# Altium project SPT3G_LCTestBoard_Rev0.PrjPcb
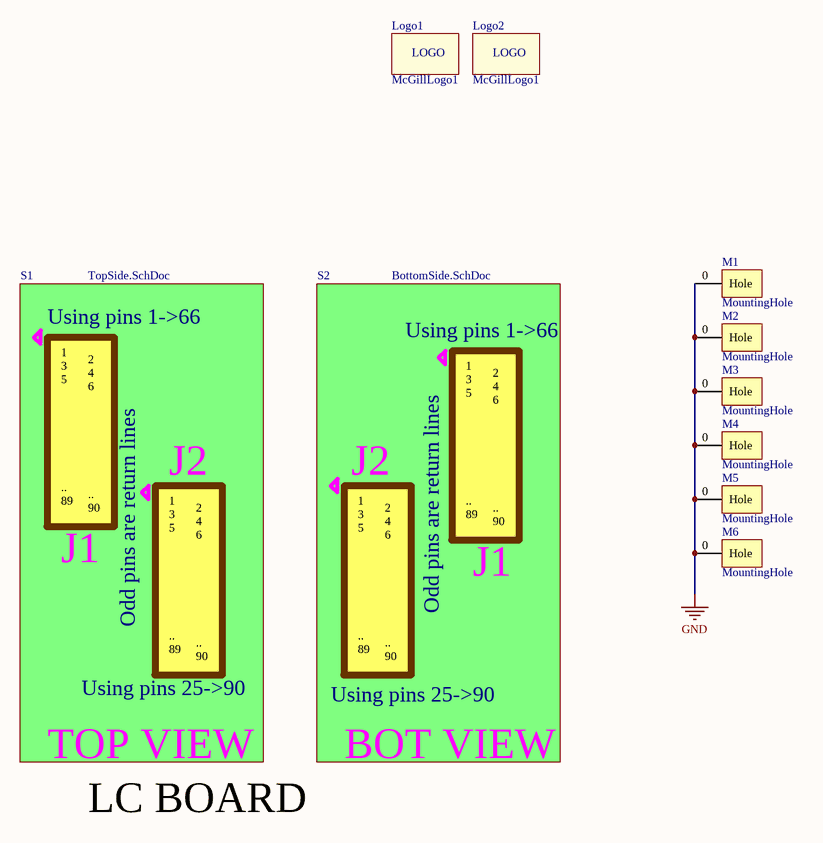
[diagram p0: TopLevelSchem.SchDoc]
DrawnBy: Adam Gilbert & Amy Bender; ProjectTitle: SPT3G LC board
4 sheets, 144 parts. Net scope: flat (ports and power ports of the same name join across sheets).
Board file: SPT3G_LCTestBoard.PcbDoc
Sheets:
  TopLevelSchem.SchDoc
    S1 = TopSide.SchDoc
      A = Resistors.SchDoc
    S2 = BottomSide.SchDoc
      B = Resistors.SchDoc

## Sheet TopLevelSchem.SchDoc
size Letter; DrawnBy: Adam Gilbert; Organization: Altium Limited; Address1: L3, 12a Rodborough Rd; Address2: Frenchs Forest; Address3: NSW; Address4: Australia 2086; DocumentNumber: 1; SheetNumber: 1; SheetTotal: 4

### Parts
Logo1  McGillLogo1  [McGillLogo1]  (no BOM)
Logo2  McGillLogo1  [McGillLogo1]  (no BOM)
M1  MountingHole  [MountingHole]  (no BOM)
M2  MountingHole  [MountingHole]  (no BOM)
M3  MountingHole  [MountingHole]  (no BOM)
M4  MountingHole  [MountingHole]  (no BOM)
M5  MountingHole  [MountingHole]  (no BOM)
M6  MountingHole  [MountingHole]  (no BOM)

### Sub-sheets
S1 = TopSide.SchDoc: no entries
S2 = BottomSide.SchDoc: no entries

### Nets
GND: M1.0(Hole) M2.0(Hole) M3.0(Hole) M4.0(Hole) M5.0(Hole) M6.0(Hole)

### Notes on the sheet
- Using pins 1->66
- 1
  3
  5
  ..
  89
- 2
  4
  6
  ..
  90
- J2
- J1
- Odd pins are return lines
- Using pins 25->90
- TOP VIEW
- BOT VIEW
- LC BOARD
- Title
- Size:
- Date:
- Letter
- Number:
- Time:
- Revision:
- Sheet
- of
- Cosmology
- File:
- (in symbol Logo) LOGO

### Library data of the parts
Logo1 Logo2 = Logo

## Sheet TopSide.SchDoc
size Letter; DrawnBy: Adam Gilbert; Organization: Altium Limited; Address1: L3, 12a Rodborough Rd; Address2: Frenchs Forest; Address3: NSW; Address4: Australia 2086; DocumentNumber: 2; SheetNumber: 2; SheetTotal: 4
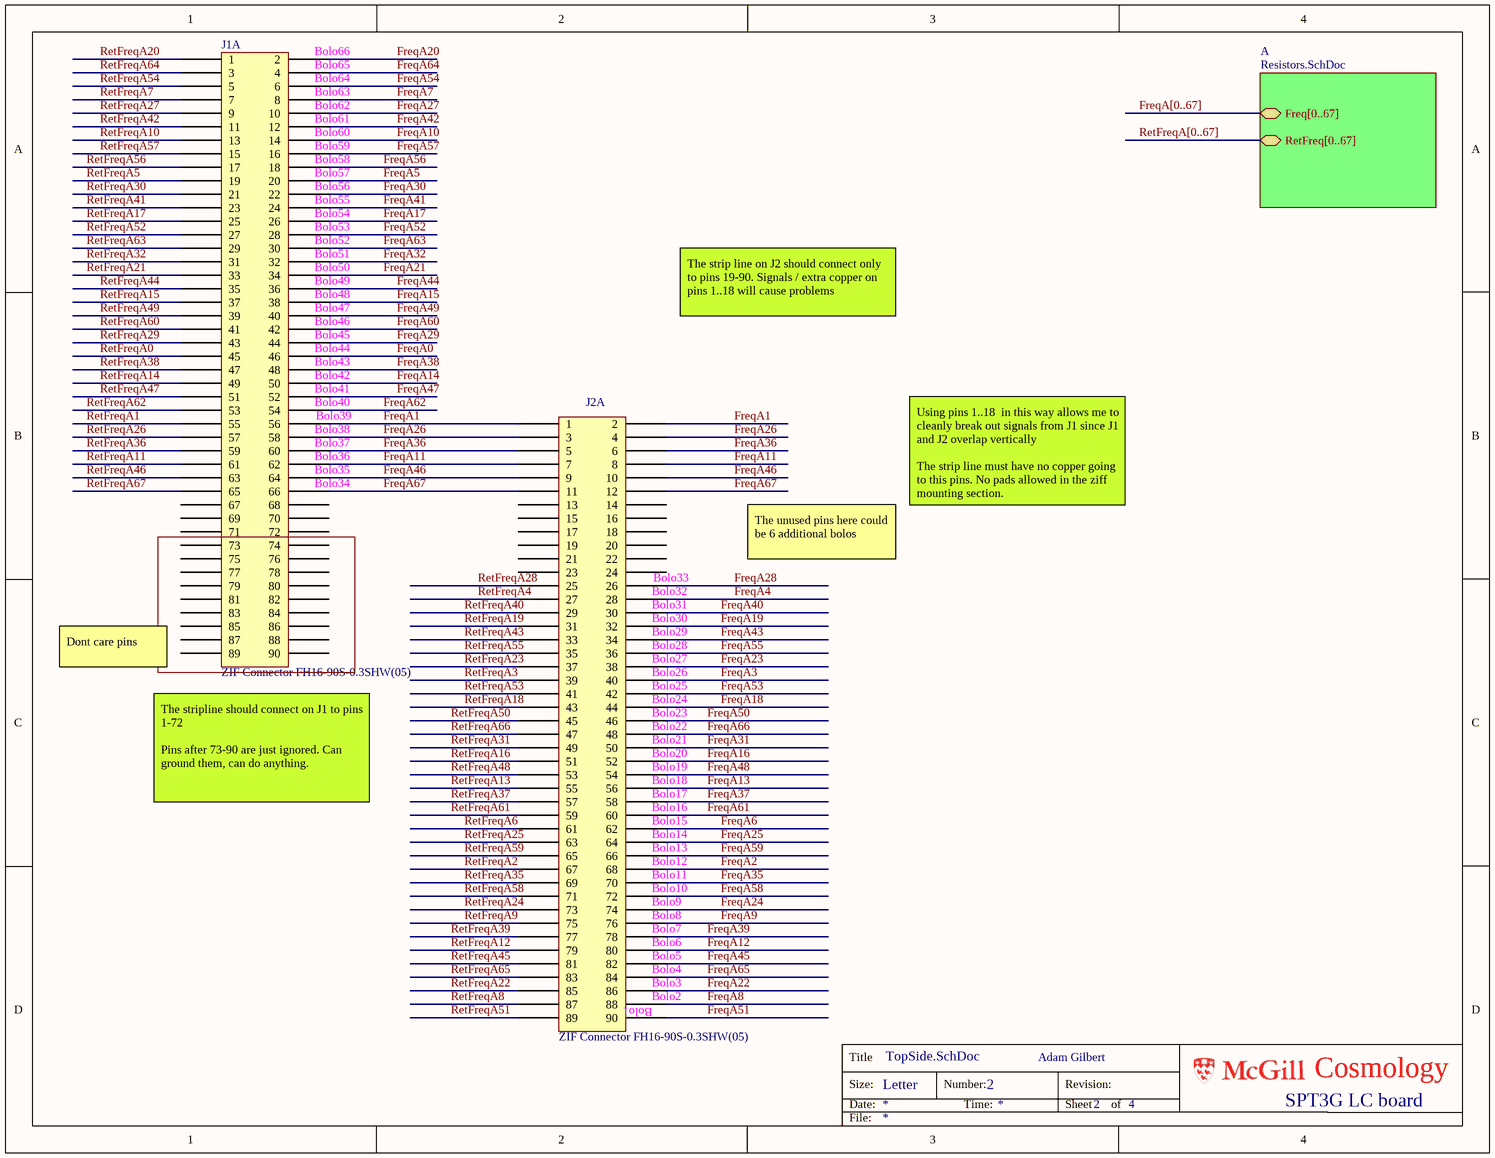
[diagram p1: TopSide.SchDoc]

### Parts
J1A  ZIF Connector FH16-90S-0.3SHW(05)  [LCBoard_ZIFCon]
J2A  ZIF Connector FH16-90S-0.3SHW(05)  [LCBoard_ZIFCon]

### Sub-sheets
A = Resistors.SchDoc: Freq[0..67], RetFreq[0..67]

### Nets
FreqA0: J1A.46
FreqA1: J1A.56 J2A.1 J2A.2
FreqA2: J2A.68
FreqA3: J2A.40
FreqA4: J2A.28
FreqA5: J1A.20
FreqA6: J2A.62
FreqA7: J1A.8
FreqA8: J2A.88
FreqA9: J2A.76
FreqA10: J1A.14
FreqA11: J1A.62 J2A.7 J2A.8
FreqA12: J2A.80
FreqA13: J2A.56
FreqA14: J1A.50
FreqA15: J1A.38
FreqA16: J2A.52
FreqA17: J1A.26
FreqA18: J2A.44
FreqA19: J2A.32
FreqA20: J1A.2
FreqA21: J1A.34
FreqA22: J2A.86
FreqA23: J2A.38
FreqA24: J2A.74
FreqA25: J2A.64
FreqA26: J1A.58 J2A.3 J2A.4
FreqA27: J1A.10
FreqA28: J2A.26
FreqA29: J1A.44
FreqA30: J1A.22
FreqA31: J2A.50
FreqA32: J1A.32
FreqA35: J2A.70
FreqA36: J1A.60 J2A.5 J2A.6
FreqA37: J2A.58
FreqA38: J1A.48
FreqA39: J2A.78
FreqA40: J2A.30
FreqA41: J1A.24
FreqA42: J1A.12
FreqA43: J2A.34
FreqA44: J1A.36
FreqA45: J2A.82
FreqA46: J1A.64 J2A.9 J2A.10
FreqA47: J1A.52
FreqA48: J2A.54
FreqA49: J1A.40
FreqA50: J2A.46
FreqA51: J2A.90
FreqA52: J1A.28
FreqA53: J2A.42
FreqA54: J1A.6
FreqA55: J2A.36
FreqA56: J1A.18
FreqA57: J1A.16
FreqA58: J2A.72
FreqA59: J2A.66
FreqA60: J1A.42
FreqA61: J2A.60
FreqA62: J1A.54
FreqA63: J1A.30
FreqA64: J1A.4
FreqA65: J2A.84
FreqA66: J2A.48
FreqA67: J1A.66 J2A.11 J2A.12
RetFreqA0: J1A.45
RetFreqA1: J1A.55
RetFreqA2: J2A.67
RetFreqA3: J2A.39
RetFreqA4: J2A.27
RetFreqA5: J1A.19
RetFreqA6: J2A.61
RetFreqA7: J1A.7
RetFreqA8: J2A.87
RetFreqA9: J2A.75
RetFreqA10: J1A.13
RetFreqA11: J1A.61
RetFreqA12: J2A.79
RetFreqA13: J2A.55
RetFreqA14: J1A.49
RetFreqA15: J1A.37
RetFreqA16: J2A.51
RetFreqA17: J1A.25
RetFreqA18: J2A.43
RetFreqA19: J2A.31
RetFreqA20: J1A.1
RetFreqA21: J1A.33
RetFreqA22: J2A.85
RetFreqA23: J2A.37
RetFreqA24: J2A.73
RetFreqA25: J2A.63
RetFreqA26: J1A.57
RetFreqA27: J1A.9
RetFreqA28: J2A.25
RetFreqA29: J1A.43
RetFreqA30: J1A.21
RetFreqA31: J2A.49
RetFreqA32: J1A.31
RetFreqA35: J2A.69
RetFreqA36: J1A.59
RetFreqA37: J2A.57
RetFreqA38: J1A.47
RetFreqA39: J2A.77
RetFreqA40: J2A.29
RetFreqA41: J1A.23
RetFreqA42: J1A.11
RetFreqA43: J2A.33
RetFreqA44: J1A.35
RetFreqA45: J2A.81
RetFreqA46: J1A.63
RetFreqA47: J1A.51
RetFreqA48: J2A.53
RetFreqA49: J1A.39
RetFreqA50: J2A.45
RetFreqA51: J2A.89
RetFreqA52: J1A.27
RetFreqA53: J2A.41
RetFreqA54: J1A.5
RetFreqA55: J2A.35
RetFreqA56: J1A.17
RetFreqA57: J1A.15
RetFreqA58: J2A.71
RetFreqA59: J2A.65
RetFreqA60: J1A.41
RetFreqA61: J2A.59
RetFreqA62: J1A.53
RetFreqA63: J1A.29
RetFreqA64: J1A.3
RetFreqA65: J2A.83
RetFreqA66: J2A.47
RetFreqA67: J1A.65

Not connected (* = marked no-connect by the designer): J1A 67 68 69 70 71 72 73 74 75 76 77 78 79 80 81 82 83 84 85 86 87 88 89 90; J2A 13 14 15 16 17 18 19 20 21 22 23 24

### Buses and harness runs
bus FreqA[0..67] = sheet A/Freq[0..67]
bus RetFreqA[0..67] = sheet A/RetFreq[0..67]

### Notes on the sheet
- (near J1A) Bolo63
- (near J1A) Bolo64
- (near J1A) Bolo65
- (near J1A) Bolo66
- (near J1A) Bolo58
- (near J1A) Bolo59
- (near J1A) Bolo60
- (near J1A) Bolo61
- (near J1A) Bolo62
- (near J1A) Bolo53
- (near J1A) Bolo54
- (near J1A) Bolo55
- (near J1A) Bolo56
- (near J1A) Bolo57
- (near J1A) Bolo48
- (near J1A) Bolo49
- (near J1A) Bolo50
- (near J1A) Bolo51
- (near J1A) Bolo52
- (near J1A) Bolo43
- (near J1A) Bolo44
- (near J1A) Bolo45
- (near J1A) Bolo46
- (near J1A) Bolo47
- The strip line on J2 should connect only to pins 19-90. Signals / extra copper on pins 1..18 will cause problems
- (near J1A) Bolo40
- (near J1A) Bolo41
- (near J1A) Bolo42
- (near J1A) Bolo38
- (near J1A) Bolo39
- (near J1A) Bolo34
- (near J1A) Bolo35
- (near J1A) Bolo36
- (near J1A) Bolo37
- Using pins 1..18  in this way allows me to cleanly break out signals from J1 since J1 and J2 overlap vertically
  The strip line must have no copper going to this pins. No pads allowed in the ziff mounting section.
- The unused pins here could be 6 additional bolos
- (near J2A) Bolo29
- (near J2A) Bolo30
- (near J2A) Bolo31
- (near J2A) Bolo32
- (near J2A) Bolo33
- Dont care pins
- (near J2A) Bolo24
- (near J2A) Bolo25
- (near J2A) Bolo26
- (near J2A) Bolo27
- (near J2A) Bolo28
- (near J2A) Bolo19
- (near J2A) Bolo20
- (near J2A) Bolo21
- (near J2A) Bolo22
- (near J2A) Bolo23
- (near J1A) The stripline should connect on J1 to pins 1-72
  Pins after 73-90 are just ignored. Can ground them, can do anything.
- (near J2A) Bolo14
- (near J2A) Bolo15
- (near J2A) Bolo16
- (near J2A) Bolo17
- (near J2A) Bolo18
- (near J2A) Bolo9
- (near J2A) Bolo10
- (near J2A) Bolo11
- (near J2A) Bolo12
- (near J2A) Bolo13
- (near J2A) Bolo4
- (near J2A) Bolo5
- (near J2A) Bolo6
- (near J2A) Bolo7
- (near J2A) Bolo8
- (near J2A) Bolo2
- (near J2A) Bolo3
- (near J2A) Bolo1
- Title
- Size:
- Date:
- Letter
- Number:
- Time:
- Revision:
- Sheet
- of
- Cosmology
- File:

### Library data of the parts
J1A J2A = LCboard_FH16-90S-0.3SHW(05)

## Sheet Resistors.SchDoc
size Letter; DrawnBy: Adam Gilbert; Organization: Altium Limited; Address1: L3, 12a Rodborough Rd; Address2: Frenchs Forest; Address3: NSW; Address4: Australia 2086; DocumentNumber: 4; SheetNumber: 4; SheetTotal: 4
Used 2 times, as channels S1/A, S2/B. Parts and nets are listed once, with the designators drawn on the sheet.
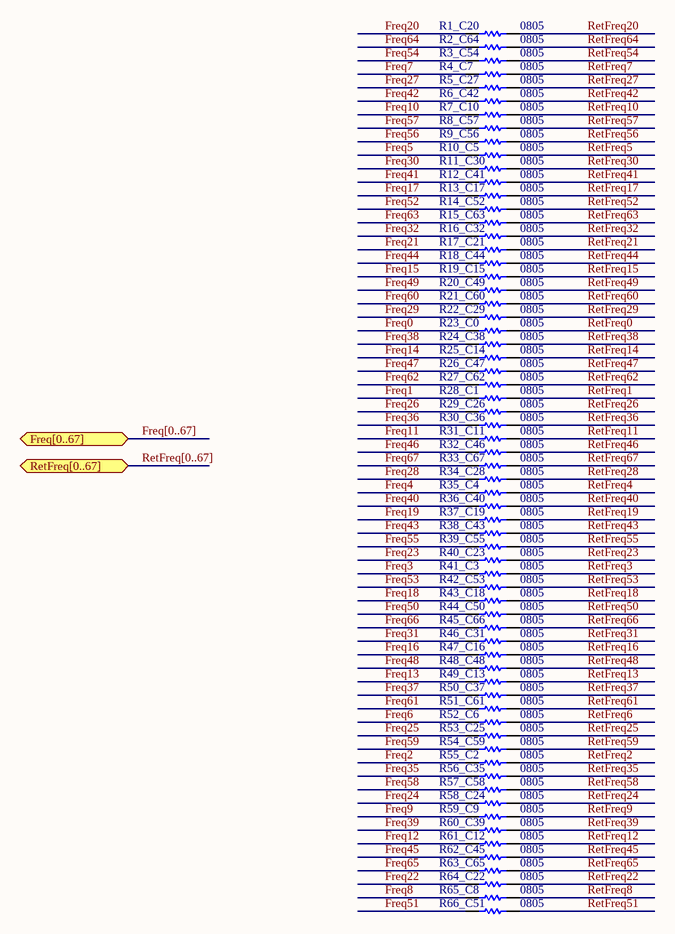
[diagram p2: Resistors.SchDoc]

### Parts
R1_C20  Res0805  [0805]  (value not drawn)
R2_C64  Res0805  [0805]  (value not drawn)
R3_C54  Res0805  [0805]  (value not drawn)
R4_C7  Res0805  [0805]  (value not drawn)
R5_C27  Res0805  [0805]  (value not drawn)
R6_C42  Res0805  [0805]  (value not drawn)
R7_C10  Res0805  [0805]  (value not drawn)
R8_C57  Res0805  [0805]  (value not drawn)
R9_C56  Res0805  [0805]  (value not drawn)
R10_C5  Res0805  [0805]  (value not drawn)
R11_C30  Res0805  [0805]  (value not drawn)
R12_C41  Res0805  [0805]  (value not drawn)
R13_C17  Res0805  [0805]  (value not drawn)
R14_C52  Res0805  [0805]  (value not drawn)
R15_C63  Res0805  [0805]  (value not drawn)
R16_C32  Res0805  [0805]  (value not drawn)
R17_C21  Res0805  [0805]  (value not drawn)
R18_C44  Res0805  [0805]  (value not drawn)
R19_C15  Res0805  [0805]  (value not drawn)
R20_C49  Res0805  [0805]  (value not drawn)
R21_C60  Res0805  [0805]  (value not drawn)
R22_C29  Res0805  [0805]  (value not drawn)
R23_C0  Res0805  [0805]  (value not drawn)
R24_C38  Res0805  [0805]  (value not drawn)
R25_C14  Res0805  [0805]  (value not drawn)
R26_C47  Res0805  [0805]  (value not drawn)
R27_C62  Res0805  [0805]  (value not drawn)
R28_C1  Res0805  [0805]  (value not drawn)
R29_C26  Res0805  [0805]  (value not drawn)
R30_C36  Res0805  [0805]  (value not drawn)
R31_C11  Res0805  [0805]  (value not drawn)
R32_C46  Res0805  [0805]  (value not drawn)
R33_C67  Res0805  [0805]  (value not drawn)
R34_C28  Res0805  [0805]  (value not drawn)
R35_C4  Res0805  [0805]  (value not drawn)
R36_C40  Res0805  [0805]  (value not drawn)
R37_C19  Res0805  [0805]  (value not drawn)
R38_C43  Res0805  [0805]  (value not drawn)
R39_C55  Res0805  [0805]  (value not drawn)
R40_C23  Res0805  [0805]  (value not drawn)
R41_C3  Res0805  [0805]  (value not drawn)
R42_C53  Res0805  [0805]  (value not drawn)
R43_C18  Res0805  [0805]  (value not drawn)
R44_C50  Res0805  [0805]  (value not drawn)
R45_C66  Res0805  [0805]  (value not drawn)
R46_C31  Res0805  [0805]  (value not drawn)
R47_C16  Res0805  [0805]  (value not drawn)
R48_C48  Res0805  [0805]  (value not drawn)
R49_C13  Res0805  [0805]  (value not drawn)
R50_C37  Res0805  [0805]  (value not drawn)
R51_C61  Res0805  [0805]  (value not drawn)
R52_C6  Res0805  [0805]  (value not drawn)
R53_C25  Res0805  [0805]  (value not drawn)
R54_C59  Res0805  [0805]  (value not drawn)
R55_C2  Res0805  [0805]  (value not drawn)
R56_C35  Res0805  [0805]  (value not drawn)
R57_C58  Res0805  [0805]  (value not drawn)
R58_C24  Res0805  [0805]  (value not drawn)
R59_C9  Res0805  [0805]  (value not drawn)
R60_C39  Res0805  [0805]  (value not drawn)
R61_C12  Res0805  [0805]  (value not drawn)
R62_C45  Res0805  [0805]  (value not drawn)
R63_C65  Res0805  [0805]  (value not drawn)
R64_C22  Res0805  [0805]  (value not drawn)
R65_C8  Res0805  [0805]  (value not drawn)
R66_C51  Res0805  [0805]  (value not drawn)

### Ports
Freq[0..67], RetFreq[0..67]

### Nets
Freq0: R23_C0.1
Freq1: R28_C1.1
Freq2: R55_C2.1
Freq3: R41_C3.1
Freq4: R35_C4.1
Freq5: R10_C5.1
Freq6: R52_C6.1
Freq7: R4_C7.1
Freq8: R65_C8.1
Freq9: R59_C9.1
Freq10: R7_C10.1
Freq11: R31_C11.1
Freq12: R61_C12.1
Freq13: R49_C13.1
Freq14: R25_C14.1
Freq15: R19_C15.1
Freq16: R47_C16.1
Freq17: R13_C17.1
Freq18: R43_C18.1
Freq19: R37_C19.1
Freq20: R1_C20.1
Freq21: R17_C21.1
Freq22: R64_C22.1
Freq23: R40_C23.1
Freq24: R58_C24.1
Freq25: R53_C25.1
Freq26: R29_C26.1
Freq27: R5_C27.1
Freq28: R34_C28.1
Freq29: R22_C29.1
Freq30: R11_C30.1
Freq31: R46_C31.1
Freq32: R16_C32.1
Freq35: R56_C35.1
Freq36: R30_C36.1
Freq37: R50_C37.1
Freq38: R24_C38.1
Freq39: R60_C39.1
Freq40: R36_C40.1
Freq41: R12_C41.1
Freq42: R6_C42.1
Freq43: R38_C43.1
Freq44: R18_C44.1
Freq45: R62_C45.1
Freq46: R32_C46.1
Freq47: R26_C47.1
Freq48: R48_C48.1
Freq49: R20_C49.1
Freq50: R44_C50.1
Freq51: R66_C51.1
Freq52: R14_C52.1
Freq53: R42_C53.1
Freq54: R3_C54.1
Freq55: R39_C55.1
Freq56: R9_C56.1
Freq57: R8_C57.1
Freq58: R57_C58.1
Freq59: R54_C59.1
Freq60: R21_C60.1
Freq61: R51_C61.1
Freq62: R27_C62.1
Freq63: R15_C63.1
Freq64: R2_C64.1
Freq65: R63_C65.1
Freq66: R45_C66.1
Freq67: R33_C67.1
RetFreq0: R23_C0.2
RetFreq1: R28_C1.2
RetFreq2: R55_C2.2
RetFreq3: R41_C3.2
RetFreq4: R35_C4.2
RetFreq5: R10_C5.2
RetFreq6: R52_C6.2
RetFreq7: R4_C7.2
RetFreq8: R65_C8.2
RetFreq9: R59_C9.2
RetFreq10: R7_C10.2
RetFreq11: R31_C11.2
RetFreq12: R61_C12.2
RetFreq13: R49_C13.2
RetFreq14: R25_C14.2
RetFreq15: R19_C15.2
RetFreq16: R47_C16.2
RetFreq17: R13_C17.2
RetFreq18: R43_C18.2
RetFreq19: R37_C19.2
RetFreq20: R1_C20.2
RetFreq21: R17_C21.2
RetFreq22: R64_C22.2
RetFreq23: R40_C23.2
RetFreq24: R58_C24.2
RetFreq25: R53_C25.2
RetFreq26: R29_C26.2
RetFreq27: R5_C27.2
RetFreq28: R34_C28.2
RetFreq29: R22_C29.2
RetFreq30: R11_C30.2
RetFreq31: R46_C31.2
RetFreq32: R16_C32.2
RetFreq35: R56_C35.2
RetFreq36: R30_C36.2
RetFreq37: R50_C37.2
RetFreq38: R24_C38.2
RetFreq39: R60_C39.2
RetFreq40: R36_C40.2
RetFreq41: R12_C41.2
RetFreq42: R6_C42.2
RetFreq43: R38_C43.2
RetFreq44: R18_C44.2
RetFreq45: R62_C45.2
RetFreq46: R32_C46.2
RetFreq47: R26_C47.2
RetFreq48: R48_C48.2
RetFreq49: R20_C49.2
RetFreq50: R44_C50.2
RetFreq51: R66_C51.2
RetFreq52: R14_C52.2
RetFreq53: R42_C53.2
RetFreq54: R3_C54.2
RetFreq55: R39_C55.2
RetFreq56: R9_C56.2
RetFreq57: R8_C57.2
RetFreq58: R57_C58.2
RetFreq59: R54_C59.2
RetFreq60: R21_C60.2
RetFreq61: R51_C61.2
RetFreq62: R27_C62.2
RetFreq63: R15_C63.2
RetFreq64: R2_C64.2
RetFreq65: R63_C65.2
RetFreq66: R45_C66.2
RetFreq67: R33_C67.2

### Channels
S1/A: designators end in _A
S2/B: designators end in _B

### Buses and harness runs
bus Freq[0..67] = port Freq[0..67]
bus RetFreq[0..67] = port RetFreq[0..67]

### Notes on the sheet
- Title
- Size:
- Date:
- Letter
- Number:
- Time:
- Revision:
- Sheet
- of
- Cosmology
- File:

### Library data of the parts
R1_C20 R2_C64 R3_C54 R4_C7 R5_C27 R6_C42 R7_C10 R8_C57 R9_C56 R10_C5 R11_C30 R12_C41 R13_C17 R14_C52 R15_C63 R16_C32 R17_C21 R18_C44 R19_C15 R20_C49 R21_C60 R22_C29 R23_C0 R24_C38 R25_C14 R26_C47 R27_C62 R28_C1 R29_C26 R30_C36 R31_C11 R32_C46 R33_C67 R34_C28 R35_C4 R36_C40 R37_C19 R38_C43 R39_C55 R40_C23 R41_C3 R42_C53 R43_C18 R44_C50 R45_C66 R46_C31 R47_C16 R48_C48 R49_C13 R50_C37 R51_C61 R52_C6 R53_C25 R54_C59 R55_C2 R56_C35 R57_C58 R58_C24 R59_C9 R60_C39 R61_C12 R62_C45 R63_C65 R64_C22 R65_C8 R66_C51 = Res0805: Resistor; Param1: 100ppm/C; Param: 1%; TechInfo: *; Value: Value

## Sheet BottomSide.SchDoc
size Letter; DrawnBy: Adam Gilbert; Organization: Altium Limited; Address1: L3, 12a Rodborough Rd; Address2: Frenchs Forest; Address3: NSW; Address4: Australia 2086; DocumentNumber: 3; SheetNumber: 3; SheetTotal: 4
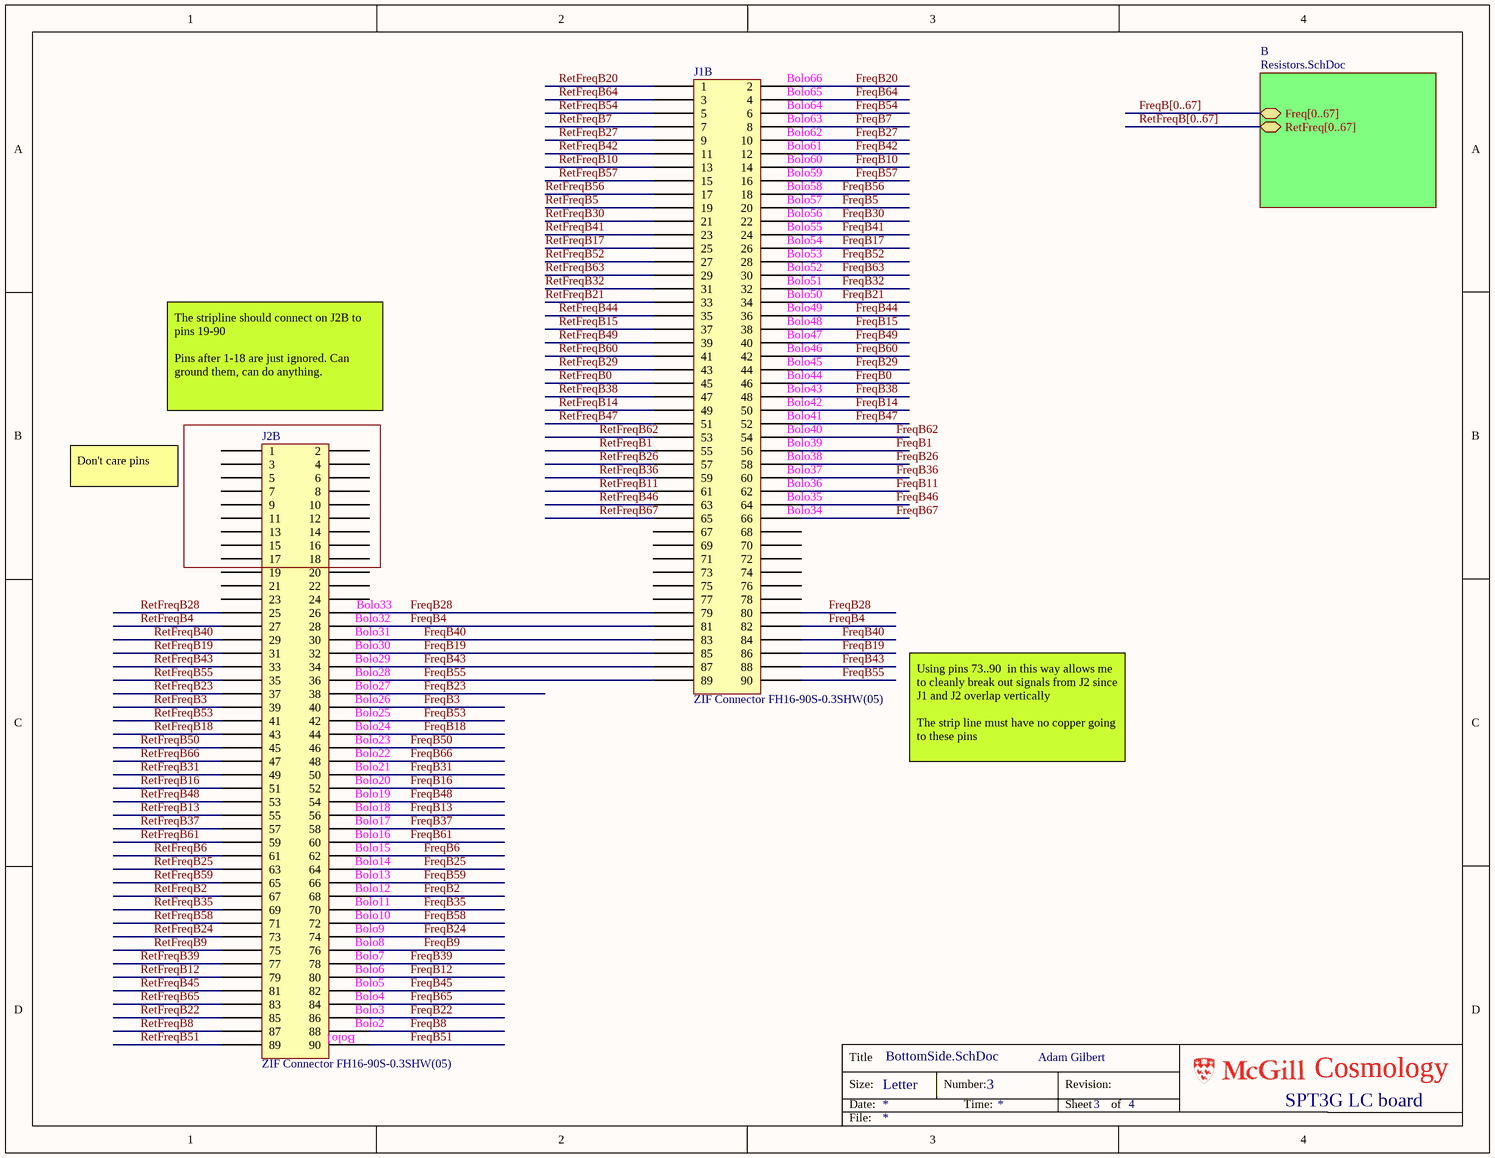
[diagram p3: BottomSide.SchDoc]

### Parts
J1B  ZIF Connector FH16-90S-0.3SHW(05)  [LCBoard_ZIFCon]
J2B  ZIF Connector FH16-90S-0.3SHW(05)  [LCBoard_ZIFCon]

### Sub-sheets
B = Resistors.SchDoc: Freq[0..67], RetFreq[0..67]

### Nets
FreqB0: J1B.46
FreqB1: J1B.56
FreqB2: J2B.68
FreqB3: J2B.40
FreqB4: J1B.81 J1B.82 J2B.28
FreqB5: J1B.20
FreqB6: J2B.62
FreqB7: J1B.8
FreqB8: J2B.88
FreqB9: J2B.76
FreqB10: J1B.14
FreqB11: J1B.62
FreqB12: J2B.80
FreqB13: J2B.56
FreqB14: J1B.50
FreqB15: J1B.38
FreqB16: J2B.52
FreqB17: J1B.26
FreqB18: J2B.44
FreqB19: J1B.85 J1B.86 J2B.32
FreqB20: J1B.2
FreqB21: J1B.34
FreqB22: J2B.86
FreqB23: J2B.38
FreqB24: J2B.74
FreqB25: J2B.64
FreqB26: J1B.58
FreqB27: J1B.10
FreqB28: J1B.79 J1B.80 J2B.26
FreqB29: J1B.44
FreqB30: J1B.22
FreqB31: J2B.50
FreqB32: J1B.32
FreqB35: J2B.70
FreqB36: J1B.60
FreqB37: J2B.58
FreqB38: J1B.48
FreqB39: J2B.78
FreqB40: J1B.83 J1B.84 J2B.30
FreqB41: J1B.24
FreqB42: J1B.12
FreqB43: J1B.87 J1B.88 J2B.34
FreqB44: J1B.36
FreqB45: J2B.82
FreqB46: J1B.64
FreqB47: J1B.52
FreqB48: J2B.54
FreqB49: J1B.40
FreqB50: J2B.46
FreqB51: J2B.90
FreqB52: J1B.28
FreqB53: J2B.42
FreqB54: J1B.6
FreqB55: J1B.89 J1B.90 J2B.36
FreqB56: J1B.18
FreqB57: J1B.16
FreqB58: J2B.72
FreqB59: J2B.66
FreqB60: J1B.42
FreqB61: J2B.60
FreqB62: J1B.54
FreqB63: J1B.30
FreqB64: J1B.4
FreqB65: J2B.84
FreqB66: J2B.48
FreqB67: J1B.66
RetFreqB0: J1B.45
RetFreqB1: J1B.55
RetFreqB2: J2B.67
RetFreqB3: J2B.39
RetFreqB4: J2B.27
RetFreqB5: J1B.19
RetFreqB6: J2B.61
RetFreqB7: J1B.7
RetFreqB8: J2B.87
RetFreqB9: J2B.75
RetFreqB10: J1B.13
RetFreqB11: J1B.61
RetFreqB12: J2B.79
RetFreqB13: J2B.55
RetFreqB14: J1B.49
RetFreqB15: J1B.37
RetFreqB16: J2B.51
RetFreqB17: J1B.25
RetFreqB18: J2B.43
RetFreqB19: J2B.31
RetFreqB20: J1B.1
RetFreqB21: J1B.33
RetFreqB22: J2B.85
RetFreqB23: J2B.37
RetFreqB24: J2B.73
RetFreqB25: J2B.63
RetFreqB26: J1B.57
RetFreqB27: J1B.9
RetFreqB28: J2B.25
RetFreqB29: J1B.43
RetFreqB30: J1B.21
RetFreqB31: J2B.49
RetFreqB32: J1B.31
RetFreqB35: J2B.69
RetFreqB36: J1B.59
RetFreqB37: J2B.57
RetFreqB38: J1B.47
RetFreqB39: J2B.77
RetFreqB40: J2B.29
RetFreqB41: J1B.23
RetFreqB42: J1B.11
RetFreqB43: J2B.33
RetFreqB44: J1B.35
RetFreqB45: J2B.81
RetFreqB46: J1B.63
RetFreqB47: J1B.51
RetFreqB48: J2B.53
RetFreqB49: J1B.39
RetFreqB50: J2B.45
RetFreqB51: J2B.89
RetFreqB52: J1B.27
RetFreqB53: J2B.41
RetFreqB54: J1B.5
RetFreqB55: J2B.35
RetFreqB56: J1B.17
RetFreqB57: J1B.15
RetFreqB58: J2B.71
RetFreqB59: J2B.65
RetFreqB60: J1B.41
RetFreqB61: J2B.59
RetFreqB62: J1B.53
RetFreqB63: J1B.29
RetFreqB64: J1B.3
RetFreqB65: J2B.83
RetFreqB66: J2B.47
RetFreqB67: J1B.65

Not connected (* = marked no-connect by the designer): J1B 67 68 69 70 71 72 73 74 75 76 77 78; J2B 1 2 3 4 5 6 7 8 9 10 11 12 13 14 15 16 17 18 19 20 21 22 23 24

### Buses and harness runs
bus FreqB[0..67] = sheet B/Freq[0..67]
bus RetFreqB[0..67] = sheet B/RetFreq[0..67]

### Notes on the sheet
- (near J1B) Bolo65
- (near J1B) Bolo66
- (near J1B) Bolo60
- (near J1B) Bolo61
- (near J1B) Bolo62
- (near J1B) Bolo63
- (near J1B) Bolo64
- (near J1B) Bolo55
- (near J1B) Bolo56
- (near J1B) Bolo57
- (near J1B) Bolo58
- (near J1B) Bolo59
- (near J1B) Bolo50
- (near J1B) Bolo51
- (near J1B) Bolo52
- (near J1B) Bolo53
- (near J1B) Bolo54
- (near J1B) Bolo45
- (near J1B) Bolo46
- (near J1B) Bolo47
- (near J1B) Bolo48
- (near J1B) Bolo49
- (near J2B) The stripline should connect on J2B to pins 19-90
  Pins after 1-18 are just ignored. Can ground them, can do anything.
- (near J1B) Bolo40
- (near J1B) Bolo41
- (near J1B) Bolo42
- (near J1B) Bolo43
- (near J1B) Bolo44
- Don't care pins
- (near J1B) Bolo35
- (near J1B) Bolo36
- (near J1B) Bolo37
- (near J1B) Bolo38
- (near J1B) Bolo39
- (near J1B) Bolo34
- (near J2B) Bolo31
- (near J2B) Bolo32
- (near J2B) Bolo33
- (near J2B) Bolo26
- (near J2B) Bolo27
- (near J2B) Bolo28
- (near J2B) Bolo29
- (near J2B) Bolo30
- (near J2B) Bolo21
- (near J2B) Bolo22
- (near J2B) Bolo23
- (near J2B) Bolo24
- (near J2B) Bolo25
- Using pins 73..90  in this way allows me to cleanly break out signals from J2 since J1 and J2 overlap vertically
  The strip line must have no copper going to these pins
- (near J2B) Bolo16
- (near J2B) Bolo17
- (near J2B) Bolo18
- (near J2B) Bolo19
- (near J2B) Bolo20
- (near J2B) Bolo11
- (near J2B) Bolo12
- (near J2B) Bolo13
- (near J2B) Bolo14
- (near J2B) Bolo15
- (near J2B) Bolo6
- (near J2B) Bolo7
- (near J2B) Bolo8
- (near J2B) Bolo9
- (near J2B) Bolo10
- (near J2B) Bolo2
- (near J2B) Bolo3
- (near J2B) Bolo4
- (near J2B) Bolo5
- (near J2B) Bolo1
- Title
- Size:
- Date:
- Letter
- Number:
- Time:
- Revision:
- Sheet
- of
- Cosmology
- File:

### Library data of the parts
J1B J2B = LCboard_FH16-90S-0.3SHW(05)

## Nets that join several sheets
Freq0: S1/A (R23_C0_A.1), S2/B (R23_C0_B.1)
Freq1: S1/A (R28_C1_A.1), S2/B (R28_C1_B.1)
Freq2: S1/A (R55_C2_A.1), S2/B (R55_C2_B.1)
Freq3: S1/A (R41_C3_A.1), S2/B (R41_C3_B.1)
Freq4: S1/A (R35_C4_A.1), S2/B (R35_C4_B.1)
Freq5: S1/A (R10_C5_A.1), S2/B (R10_C5_B.1)
Freq6: S1/A (R52_C6_A.1), S2/B (R52_C6_B.1)
Freq7: S1/A (R4_C7_A.1), S2/B (R4_C7_B.1)
Freq8: S1/A (R65_C8_A.1), S2/B (R65_C8_B.1)
Freq9: S1/A (R59_C9_A.1), S2/B (R59_C9_B.1)
Freq10: S1/A (R7_C10_A.1), S2/B (R7_C10_B.1)
Freq11: S1/A (R31_C11_A.1), S2/B (R31_C11_B.1)
Freq12: S1/A (R61_C12_A.1), S2/B (R61_C12_B.1)
Freq13: S1/A (R49_C13_A.1), S2/B (R49_C13_B.1)
Freq14: S1/A (R25_C14_A.1), S2/B (R25_C14_B.1)
Freq15: S1/A (R19_C15_A.1), S2/B (R19_C15_B.1)
Freq16: S1/A (R47_C16_A.1), S2/B (R47_C16_B.1)
Freq17: S1/A (R13_C17_A.1), S2/B (R13_C17_B.1)
Freq18: S1/A (R43_C18_A.1), S2/B (R43_C18_B.1)
Freq19: S1/A (R37_C19_A.1), S2/B (R37_C19_B.1)
Freq20: S1/A (R1_C20_A.1), S2/B (R1_C20_B.1)
Freq21: S1/A (R17_C21_A.1), S2/B (R17_C21_B.1)
Freq22: S1/A (R64_C22_A.1), S2/B (R64_C22_B.1)
Freq23: S1/A (R40_C23_A.1), S2/B (R40_C23_B.1)
Freq24: S1/A (R58_C24_A.1), S2/B (R58_C24_B.1)
Freq25: S1/A (R53_C25_A.1), S2/B (R53_C25_B.1)
Freq26: S1/A (R29_C26_A.1), S2/B (R29_C26_B.1)
Freq27: S1/A (R5_C27_A.1), S2/B (R5_C27_B.1)
Freq28: S1/A (R34_C28_A.1), S2/B (R34_C28_B.1)
Freq29: S1/A (R22_C29_A.1), S2/B (R22_C29_B.1)
Freq30: S1/A (R11_C30_A.1), S2/B (R11_C30_B.1)
Freq31: S1/A (R46_C31_A.1), S2/B (R46_C31_B.1)
Freq32: S1/A (R16_C32_A.1), S2/B (R16_C32_B.1)
Freq35: S1/A (R56_C35_A.1), S2/B (R56_C35_B.1)
Freq36: S1/A (R30_C36_A.1), S2/B (R30_C36_B.1)
Freq37: S1/A (R50_C37_A.1), S2/B (R50_C37_B.1)
Freq38: S1/A (R24_C38_A.1), S2/B (R24_C38_B.1)
Freq39: S1/A (R60_C39_A.1), S2/B (R60_C39_B.1)
Freq40: S1/A (R36_C40_A.1), S2/B (R36_C40_B.1)
Freq41: S1/A (R12_C41_A.1), S2/B (R12_C41_B.1)
Freq42: S1/A (R6_C42_A.1), S2/B (R6_C42_B.1)
Freq43: S1/A (R38_C43_A.1), S2/B (R38_C43_B.1)
Freq44: S1/A (R18_C44_A.1), S2/B (R18_C44_B.1)
Freq45: S1/A (R62_C45_A.1), S2/B (R62_C45_B.1)
Freq46: S1/A (R32_C46_A.1), S2/B (R32_C46_B.1)
Freq47: S1/A (R26_C47_A.1), S2/B (R26_C47_B.1)
Freq48: S1/A (R48_C48_A.1), S2/B (R48_C48_B.1)
Freq49: S1/A (R20_C49_A.1), S2/B (R20_C49_B.1)
Freq50: S1/A (R44_C50_A.1), S2/B (R44_C50_B.1)
Freq51: S1/A (R66_C51_A.1), S2/B (R66_C51_B.1)
Freq52: S1/A (R14_C52_A.1), S2/B (R14_C52_B.1)
Freq53: S1/A (R42_C53_A.1), S2/B (R42_C53_B.1)
Freq54: S1/A (R3_C54_A.1), S2/B (R3_C54_B.1)
Freq55: S1/A (R39_C55_A.1), S2/B (R39_C55_B.1)
Freq56: S1/A (R9_C56_A.1), S2/B (R9_C56_B.1)
Freq57: S1/A (R8_C57_A.1), S2/B (R8_C57_B.1)
Freq58: S1/A (R57_C58_A.1), S2/B (R57_C58_B.1)
Freq59: S1/A (R54_C59_A.1), S2/B (R54_C59_B.1)
Freq60: S1/A (R21_C60_A.1), S2/B (R21_C60_B.1)
Freq61: S1/A (R51_C61_A.1), S2/B (R51_C61_B.1)
Freq62: S1/A (R27_C62_A.1), S2/B (R27_C62_B.1)
Freq63: S1/A (R15_C63_A.1), S2/B (R15_C63_B.1)
Freq64: S1/A (R2_C64_A.1), S2/B (R2_C64_B.1)
Freq65: S1/A (R63_C65_A.1), S2/B (R63_C65_B.1)
Freq66: S1/A (R45_C66_A.1), S2/B (R45_C66_B.1)
Freq67: S1/A (R33_C67_A.1), S2/B (R33_C67_B.1)
RetFreq0: S1/A (R23_C0_A.2), S2/B (R23_C0_B.2)
RetFreq1: S1/A (R28_C1_A.2), S2/B (R28_C1_B.2)
RetFreq2: S1/A (R55_C2_A.2), S2/B (R55_C2_B.2)
RetFreq3: S1/A (R41_C3_A.2), S2/B (R41_C3_B.2)
RetFreq4: S1/A (R35_C4_A.2), S2/B (R35_C4_B.2)
RetFreq5: S1/A (R10_C5_A.2), S2/B (R10_C5_B.2)
RetFreq6: S1/A (R52_C6_A.2), S2/B (R52_C6_B.2)
RetFreq7: S1/A (R4_C7_A.2), S2/B (R4_C7_B.2)
RetFreq8: S1/A (R65_C8_A.2), S2/B (R65_C8_B.2)
RetFreq9: S1/A (R59_C9_A.2), S2/B (R59_C9_B.2)
RetFreq10: S1/A (R7_C10_A.2), S2/B (R7_C10_B.2)
RetFreq11: S1/A (R31_C11_A.2), S2/B (R31_C11_B.2)
RetFreq12: S1/A (R61_C12_A.2), S2/B (R61_C12_B.2)
RetFreq13: S1/A (R49_C13_A.2), S2/B (R49_C13_B.2)
RetFreq14: S1/A (R25_C14_A.2), S2/B (R25_C14_B.2)
RetFreq15: S1/A (R19_C15_A.2), S2/B (R19_C15_B.2)
RetFreq16: S1/A (R47_C16_A.2), S2/B (R47_C16_B.2)
RetFreq17: S1/A (R13_C17_A.2), S2/B (R13_C17_B.2)
RetFreq18: S1/A (R43_C18_A.2), S2/B (R43_C18_B.2)
RetFreq19: S1/A (R37_C19_A.2), S2/B (R37_C19_B.2)
RetFreq20: S1/A (R1_C20_A.2), S2/B (R1_C20_B.2)
RetFreq21: S1/A (R17_C21_A.2), S2/B (R17_C21_B.2)
RetFreq22: S1/A (R64_C22_A.2), S2/B (R64_C22_B.2)
RetFreq23: S1/A (R40_C23_A.2), S2/B (R40_C23_B.2)
RetFreq24: S1/A (R58_C24_A.2), S2/B (R58_C24_B.2)
RetFreq25: S1/A (R53_C25_A.2), S2/B (R53_C25_B.2)
RetFreq26: S1/A (R29_C26_A.2), S2/B (R29_C26_B.2)
RetFreq27: S1/A (R5_C27_A.2), S2/B (R5_C27_B.2)
RetFreq28: S1/A (R34_C28_A.2), S2/B (R34_C28_B.2)
RetFreq29: S1/A (R22_C29_A.2), S2/B (R22_C29_B.2)
RetFreq30: S1/A (R11_C30_A.2), S2/B (R11_C30_B.2)
RetFreq31: S1/A (R46_C31_A.2), S2/B (R46_C31_B.2)
RetFreq32: S1/A (R16_C32_A.2), S2/B (R16_C32_B.2)
RetFreq35: S1/A (R56_C35_A.2), S2/B (R56_C35_B.2)
RetFreq36: S1/A (R30_C36_A.2), S2/B (R30_C36_B.2)
RetFreq37: S1/A (R50_C37_A.2), S2/B (R50_C37_B.2)
RetFreq38: S1/A (R24_C38_A.2), S2/B (R24_C38_B.2)
RetFreq39: S1/A (R60_C39_A.2), S2/B (R60_C39_B.2)
RetFreq40: S1/A (R36_C40_A.2), S2/B (R36_C40_B.2)
RetFreq41: S1/A (R12_C41_A.2), S2/B (R12_C41_B.2)
RetFreq42: S1/A (R6_C42_A.2), S2/B (R6_C42_B.2)
RetFreq43: S1/A (R38_C43_A.2), S2/B (R38_C43_B.2)
RetFreq44: S1/A (R18_C44_A.2), S2/B (R18_C44_B.2)
RetFreq45: S1/A (R62_C45_A.2), S2/B (R62_C45_B.2)
RetFreq46: S1/A (R32_C46_A.2), S2/B (R32_C46_B.2)
RetFreq47: S1/A (R26_C47_A.2), S2/B (R26_C47_B.2)
RetFreq48: S1/A (R48_C48_A.2), S2/B (R48_C48_B.2)
RetFreq49: S1/A (R20_C49_A.2), S2/B (R20_C49_B.2)
RetFreq50: S1/A (R44_C50_A.2), S2/B (R44_C50_B.2)
RetFreq51: S1/A (R66_C51_A.2), S2/B (R66_C51_B.2)
RetFreq52: S1/A (R14_C52_A.2), S2/B (R14_C52_B.2)
RetFreq53: S1/A (R42_C53_A.2), S2/B (R42_C53_B.2)
RetFreq54: S1/A (R3_C54_A.2), S2/B (R3_C54_B.2)
RetFreq55: S1/A (R39_C55_A.2), S2/B (R39_C55_B.2)
RetFreq56: S1/A (R9_C56_A.2), S2/B (R9_C56_B.2)
RetFreq57: S1/A (R8_C57_A.2), S2/B (R8_C57_B.2)
RetFreq58: S1/A (R57_C58_A.2), S2/B (R57_C58_B.2)
RetFreq59: S1/A (R54_C59_A.2), S2/B (R54_C59_B.2)
RetFreq60: S1/A (R21_C60_A.2), S2/B (R21_C60_B.2)
RetFreq61: S1/A (R51_C61_A.2), S2/B (R51_C61_B.2)
RetFreq62: S1/A (R27_C62_A.2), S2/B (R27_C62_B.2)
RetFreq63: S1/A (R15_C63_A.2), S2/B (R15_C63_B.2)
RetFreq64: S1/A (R2_C64_A.2), S2/B (R2_C64_B.2)
RetFreq65: S1/A (R63_C65_A.2), S2/B (R63_C65_B.2)
RetFreq66: S1/A (R45_C66_A.2), S2/B (R45_C66_B.2)
RetFreq67: S1/A (R33_C67_A.2), S2/B (R33_C67_B.2)